# EAGLE board WMHS Team A Mission Possible Electrical (EAGLE 8.5.2), part 1 of 2
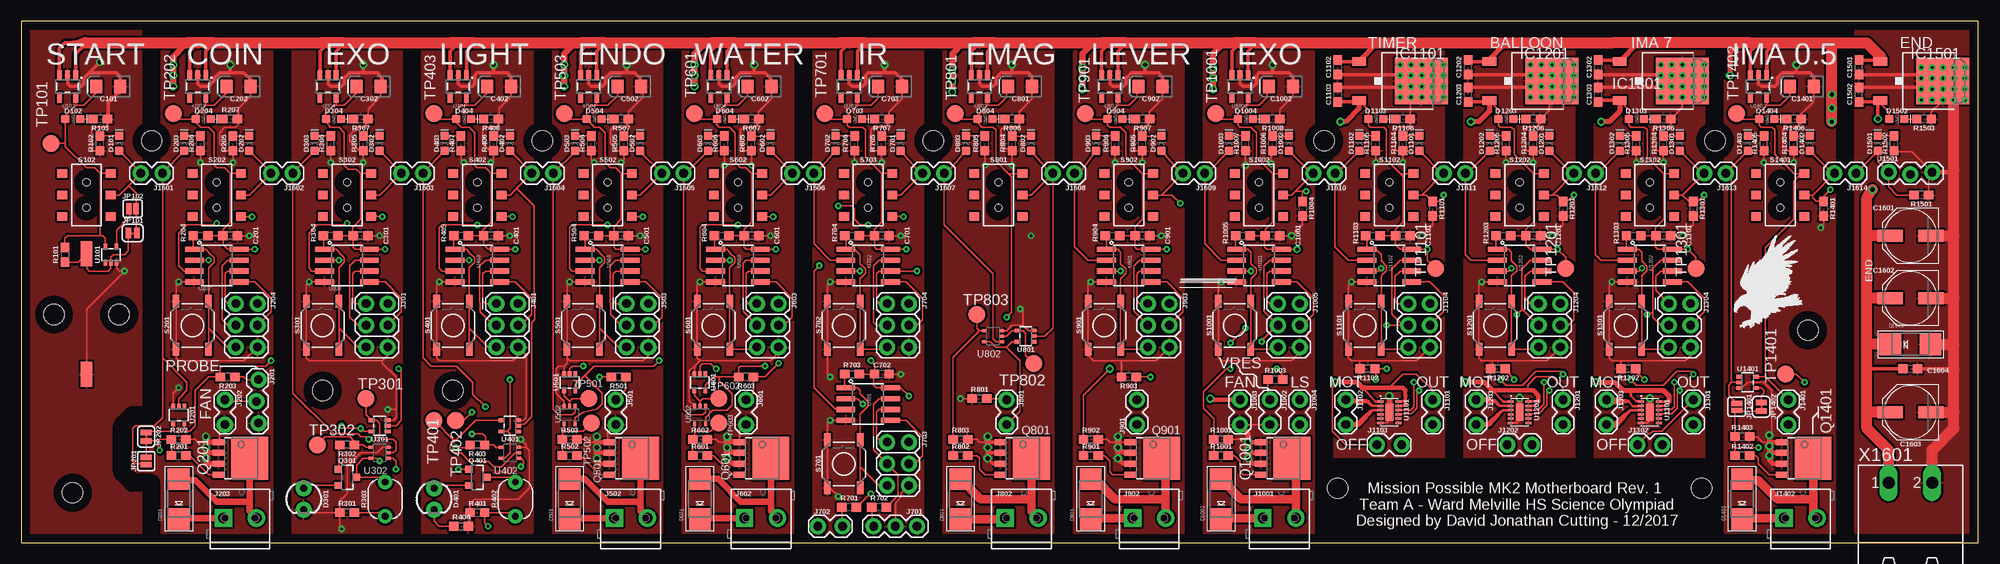
[diagram p16: board, top side]
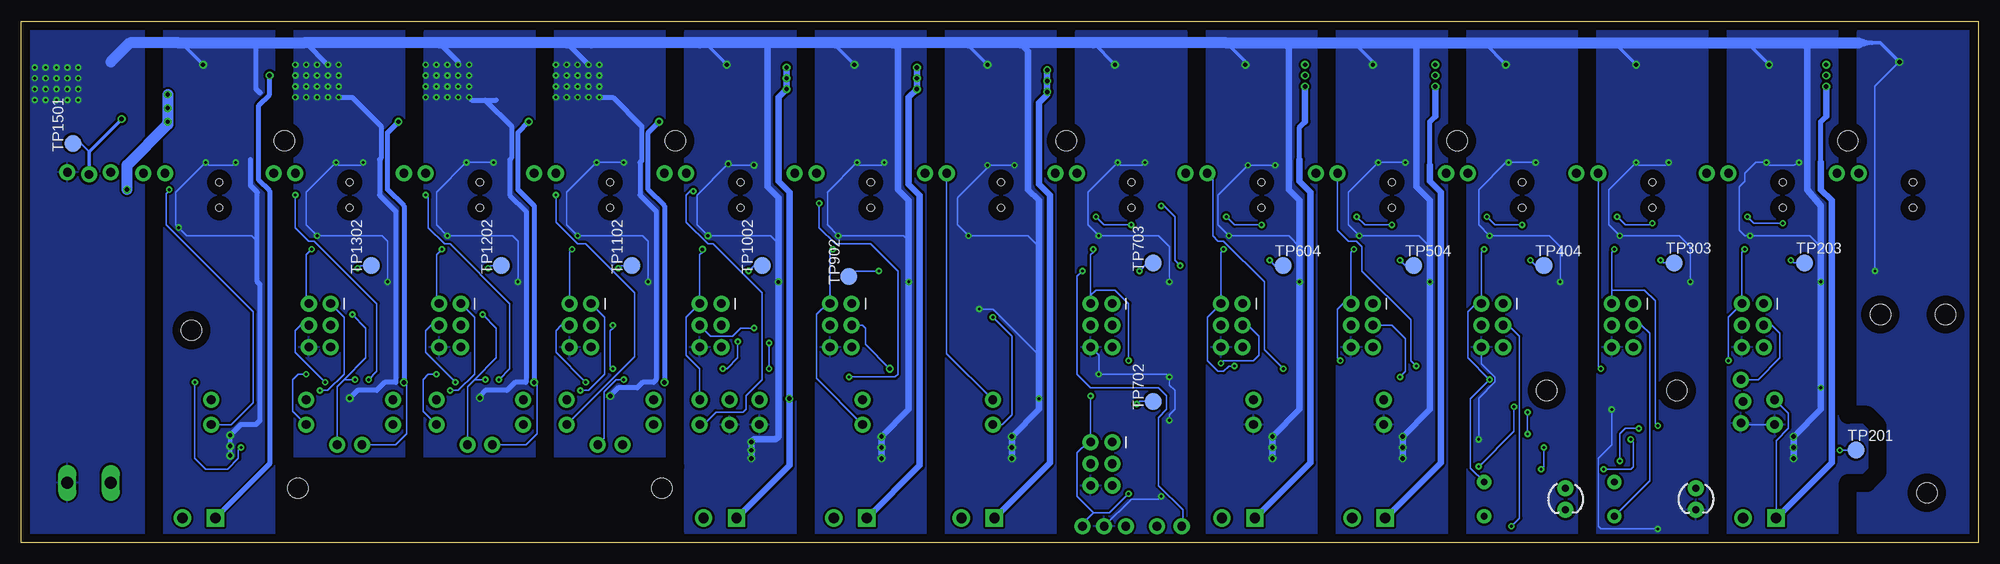
[diagram p17: board, bottom side, seen from below]

Size 228.9 x 60.95 mm. Coordinates in mm from the lower left corner, seen from the top.
Outline: 0,0 228.9,0 228.9,60.95 0,60.95 0,0
Copper layers (1*16): Top 0.035mm / dielectric 1.5mm / Bottom 0.035mm
Design rules "default *": minimum track width 6mil, minimum drill 13mil, track to track 6mil, track to pad 6mil, pad to pad 6mil, via to via 6mil, smd to smd 6mil, copper to edge 40mil, drill to drill 6mil, minimum pad ring 10mil, minimum via ring 8mil, stop-mask expansion 4mil, vias tented up to drill 25mil, thermal gap 10mil
Holes 2.4 mm at 11.43,26.67 3.81,26.67 35.24,17.78 50.48,17.78 209,24.82 6,5.82 15.24,46.99 60.96,46.99 106.68,46.99 152.4,46.99 198.12,46.99 153.99,6.35 196.53,6.35
tRestrict: 23 lines
bRestrict: 23 lines

## Footprints (pad centres in the part's own frame; a part is rotated, then mirrored left to right if it is on the bottom)
EIA3216 = smd 1.4 x 1.6: + 1.4,0; - -1.4,0
0603 = smd 1.1 x 1: 1 -0.85,0; 2 0.85,0
PANASONIC_D = smd 3 x 1.4: + 2.4,0; - -2.4,0
LED-0603 = smd 1 x 1: A -0.877,0; C 0.877,0
SMADIODE = smd 2.54 x 2.54: A 2.349,0; C -2.349,0
LED_3MM = drill 0.813 pad 1.88: A -1.27,0; K 1.27,0
TO252 = smd 1 x 1.6: 1 -2.28,-4.8; 2 2.28,-4.8 | smd 5.4 x 6.2: 3 0,2.5
1X03_LOCK = drill 1.016 pad 1.88: 1 0,0.127; 2 2.54,-0.127; 3 5.08,0.127
1X02_LOCK = drill 1.016 pad 1.88: 1 -0.178,0; 2 2.718,0
SCREWTERMINAL-3.5MM-2_LOCK = drill 1.2 pad 2.032 square: 1 -0.178,0 | drill 1.2 pad 2.032: 2 3.678,0
2X3 = drill 1.016 pad 1.88: 1 0,0; 2 0,2.54; 3 2.54,0; 4 2.54,2.54; 5 5.08,0; 6 5.08,2.54
1X03 = drill 1.016 pad 1.88: 1 0,0; 2 2.54,0; 3 5.08,0
1X02 = drill 1.016 pad 1.88: 1 0,0; 2 2.54,0
SMT-JUMPER_2_NC_TRACE_SILK = smd 0.635 x 1.27: 1 -0.508,0; 2 0.508,0
SMT-JUMPER_2_NO_SILK = smd 0.635 x 1.27: 1 -0.406,0; 2 0.406,0
SOT669 = smd 0.7 x 1.4: 1 -1.905,-2.65; 2 -0.635,-2.65; 3 0.635,-2.65; 4 1.905,-2.65 | smd 5 x 4.3: MB 0,1
SOT23-3 = smd 0.8 x 0.9: 1 -0.95,-1; 2 0.95,-1; 3 0,1.1
PHOTOCELL = drill 0.8 pad 1.676: 1 -2,0; 2 2,0
AXIAL_GULLWING_REED = smd 2.9 x 1.3: P$1 0,0; P$2 14.1,0
SWITCH_DPDT_SMD_AYZ0202 = smd 1 x 1.15: 1 -2.5,2.825; 2 0,2.825; 3 2.5,2.825; 4 -2.5,-2.825; 5 0,-2.825; 6 2.5,-2.825 | hole 0.85: 1.5,0; -1.5,0
TACTILE_SWITCH_SMD_5.2MM = smd 1.524 x 0.762: 1 -2.794,1.905; 2 2.794,1.905; 3 -2.794,-1.905; 4 2.794,-1.905
TP20R = smd 2 x 2: TP 0,0
SOT353 = smd 0.42 x 0.7: 1 -0.65,-0.95; 2 0,-0.95; 3 0.65,-0.95; 4 0.65,0.95; 5 -0.65,0.95
SOT23-5 = smd 0.55 x 1.2: 1 -0.95,-1.3; 2 0,-1.3; 3 0.95,-1.3; 4 0.95,1.3; 5 -0.95,1.3
SOIC8 = smd 0.61 x 2.21: 1 -1.905,-2.616; 2 -0.635,-2.616; 3 0.635,-2.616; 4 1.905,-2.616; 5 1.905,2.616; 6 0.635,2.616; 7 -0.635,2.616; 8 -1.905,2.616
SC-70-5 = smd 0.35 x 0.5: 1 -0.65,-1.05; 2 0,-1.05; 3 0.65,-1.05; 4 0.65,1.05; 5 -0.65,1.05
WSON-12 = smd 0.3 x 0.7: 1 -1.25,-1.05; 2 -0.75,-1.05; 3 -0.25,-1.05; 4 0.25,-1.05; 5 0.75,-1.05; 6 1.25,-1.05; 7 1.25,1.05; 8 0.75,1.05; 9 0.25,1.05; 10 -0.25,1.05; 11 -0.75,1.05; 12 -1.25,1.05 | smd 2 x 0.9: PAD 0,0
MSTBA2 = drill 1.397 long: 1 -2.54,5.08; 2 2.54,5.08

## Placement (x,y rotation side)
C101  2.2uF  [EIA3216]  10.16,53.34 180 top
C201  0.1uF  [0603]  24.45,35.88 180 top
C202  2.2uF  [EIA3216]  25.4,53.34 180 top
C301  0.1uF  [0603]  39.69,35.88 180 top
C302  2.2uF  [EIA3216]  40.64,53.34 180 top
C401  0.1uF  [0603]  54.93,35.88 180 top
C402  2.2uF  [EIA3216]  55.88,53.34 180 top
C501  0.1uF  [0603]  70.17,35.88 180 top
C502  2.2uF  [EIA3216]  71.12,53.34 180 top
C601  0.1uF  [0603]  85.41,35.88 180 top
C602  2.2uF  [EIA3216]  86.36,53.34 180 top
C701  0.1uF  [0603]  100.65,35.88 180 top
C702  0.1uF  [0603]  100.65,19.68 180 top
C703  2.2uF  [EIA3216]  101.6,53.34 180 top
C801  2.2uF  [EIA3216]  116.84,53.34 180 top
C901  0.1uF  [0603]  131.13,35.88 180 top
C902  2.2uF  [EIA3216]  132.08,53.34 180 top
C1001  0.1uF  [0603]  146.37,35.88 180 top
C1002  2.2uF  [EIA3216]  147.32,53.34 180 top
C1101  0.1uF  [0603]  161.61,35.88 180 top
C1102  0.33uF  [0603]  153.99,55.56 90 top
C1103  0.1uF  [0603]  153.99,52.39 90 top
C1201  0.1uF  [0603]  176.85,35.88 180 top
C1202  0.33uF  [0603]  169.23,55.56 90 top
C1203  0.1uF  [0603]  169.23,52.39 90 top
C1301  0.1uF  [0603]  192.09,35.88 180 top
C1302  0.33uF  [0603]  184.47,55.56 90 top
C1303  0.1uF  [0603]  184.47,52.39 90 top
C1401  2.2uF  [EIA3216]  208.28,53.34 180 top
C1501  0.33uF  [0603]  214.95,55.56 90 top
C1502  0.1uF  [0603]  214.95,52.39 90 top
C1601  100uF  [PANASONIC_D]  220.98,35.88 180 top
C1602  100uF  [PANASONIC_D]  220.98,28.57 180 top
C1603  100uF  [PANASONIC_D]  220.98,15.24 180 top
C1604  0.1uF  [0603]  220.98,20.32 0 top
D101  GREEN  [LED-0603]  11.43,46.67 90 top
D102  RED  [LED-0603]  6.03,49.53 0 top
D201  SK310A-TP  [SMADIODE]  18.41,5.08 90 top
D202  GREEN  [LED-0603]  26.67,46.67 90 top
D203  YELLOW  [LED-0603]  19.05,46.67 90 top
D204  RED  [LED-0603]  21.27,49.53 0 top
D301  INCANDESCENT  [LED_3MM]  33.02,5.08 270 top
D302  GREEN  [LED-0603]  41.91,46.67 90 top
D303  YELLOW  [LED-0603]  34.29,46.67 90 top
D304  RED  [LED-0603]  36.51,49.53 0 top
D401  WHITE  [LED_3MM]  48.26,5.08 270 top
D402  GREEN  [LED-0603]  57.15,46.67 90 top
D403  YELLOW  [LED-0603]  49.53,46.67 90 top
D404  RED  [LED-0603]  51.75,49.53 0 top
D501  SK310A-TP  [SMADIODE]  64.14,5.08 90 top
D502  GREEN  [LED-0603]  72.39,46.67 90 top
D503  YELLOW  [LED-0603]  64.77,46.67 90 top
D504  RED  [LED-0603]  66.99,49.53 0 top
D601  SK310A-TP  [SMADIODE]  79.38,5.08 90 top
D602  GREEN  [LED-0603]  87.63,46.67 90 top
D603  YELLOW  [LED-0603]  80.33,46.67 90 top
D604  RED  [LED-0603]  82.23,49.53 0 top
D701  GREEN  [LED-0603]  102.87,46.67 90 top
D702  YELLOW  [LED-0603]  95.25,46.67 90 top
D703  RED  [LED-0603]  97.47,49.53 0 top
D801  SK310A-TP  [SMADIODE]  109.86,5.08 90 top
D802  GREEN  [LED-0603]  118.11,46.67 90 top
D803  YELLOW  [LED-0603]  110.49,46.67 90 top
D804  RED  [LED-0603]  112.71,49.53 0 top
D901  SK310A-TP  [SMADIODE]  125.09,5.08 90 top
D902  GREEN  [LED-0603]  133.35,46.67 90 top
D903  YELLOW  [LED-0603]  125.73,46.67 90 top
D904  RED  [LED-0603]  127.95,49.53 0 top
D1001  SK310A-TP  [SMADIODE]  140.34,5.08 90 top
D1002  GREEN  [LED-0603]  148.27,46.67 90 top
D1003  YELLOW  [LED-0603]  141.29,46.67 90 top
D1004  RED  [LED-0603]  143.19,49.53 0 top
D1101  GREEN  [LED-0603]  163.51,46.67 90 top
D1102  YELLOW  [LED-0603]  156.53,46.67 90 top
D1103  RED  [LED-0603]  158.43,49.53 0 top
D1201  GREEN  [LED-0603]  178.75,46.67 90 top
D1202  YELLOW  [LED-0603]  171.77,46.67 90 top
D1203  RED  [LED-0603]  173.67,49.53 0 top
D1301  GREEN  [LED-0603]  193.99,46.67 90 top
D1302  YELLOW  [LED-0603]  187.01,46.67 90 top
D1303  RED  [LED-0603]  188.91,49.53 0 top
D1401  SK310A-TP  [SMADIODE]  201.29,5.08 90 top
D1402  GREEN  [LED-0603]  209.23,46.67 90 top
D1403  YELLOW  [LED-0603]  201.93,46.67 90 top
D1404  RED  [LED-0603]  204.15,49.53 0 top
D1501  YELLOW  [LED-0603]  217.17,46.67 90 top
D1502  RED  [LED-0603]  219.39,49.53 0 top
D1601  SMAJ30A  [SMADIODE]  220.98,23.18 0 top
IC1101  7805DT  [TO252]  161.29,53.98 270 top
IC1201  7805DT  [TO252]  176.53,53.98 270 top
IC1301  7805DT  [TO252]  191.77,53.98 270 top
IC1501  7805DT  [TO252]  222.25,53.98 270 top
J201  [1X03_LOCK]  27.62,19.05 270 top
J202  [1X02_LOCK]  23.81,16.51 270 top
J203  [SCREWTERMINAL-3.5MM-2_LOCK]  23.81,2.86 0 top
J204  ICSP_HEADER  [2X3]  25.08,27.94 270 top
J301  ICSP_HEADER  [2X3]  40.32,27.94 270 top
J401  ICSP_HEADER  [2X3]  55.56,27.94 270 top
J501  [1X02_LOCK]  69.53,16.51 270 top
J502  [SCREWTERMINAL-3.5MM-2_LOCK]  69.53,2.86 0 top
J503  ICSP_HEADER  [2X3]  70.8,27.94 270 top
J601  [1X02_LOCK]  84.77,16.51 270 top
J602  [SCREWTERMINAL-3.5MM-2_LOCK]  84.77,2.86 0 top
J603  ICSP_HEADER  [2X3]  86.04,27.94 270 top
J701  [1X03]  99.69,1.91 0 top
J702  [1X02_LOCK]  93.34,1.91 0 top
J703  ICSP_HEADER  [2X3]  101.28,11.75 270 top
J704  ICSP_HEADER  [2X3]  101.28,27.94 270 top
J801  [1X02_LOCK]  115.25,16.51 270 top
J802  [SCREWTERMINAL-3.5MM-2_LOCK]  115.25,2.86 0 top
J901  [1X02_LOCK]  130.49,13.97 90 top
J902  [SCREWTERMINAL-3.5MM-2_LOCK]  130.18,2.86 0 top
J903  ICSP_HEADER  [2X3]  131.76,27.94 270 top
J1001  [SCREWTERMINAL-3.5MM-2_LOCK]  145.41,2.86 0 top
J1002  [1X02_LOCK]  146.05,16.51 270 top
J1003  [1X02_LOCK]  142.56,16.51 270 top
J1004  [1X02_LOCK]  149.54,16.51 270 top
J1005  ICSP_HEADER  [2X3]  147,27.94 270 top
J1101  [1X02_LOCK]  165.1,16.51 270 top
J1102  [1X02_LOCK]  154.94,16.51 270 top
J1103  [1X02_LOCK]  158.75,11.43 0 top
J1104  ICSP_HEADER  [2X3]  162.24,27.94 270 top
J1201  [1X02_LOCK]  180.34,16.51 270 top
J1202  [1X02_LOCK]  173.99,11.43 0 top
J1203  [1X02_LOCK]  170.18,16.51 270 top
J1204  ICSP_HEADER  [2X3]  177.48,27.94 270 top
J1301  [1X02_LOCK]  195.58,16.51 270 top
J1302  [1X02_LOCK]  189.23,11.43 0 top
J1303  [1X02_LOCK]  185.42,16.51 270 top
J1304  ICSP_HEADER  [2X3]  192.72,27.94 270 top
J1401  [1X02_LOCK]  206.69,16.51 270 top
J1402  [SCREWTERMINAL-3.5MM-2_LOCK]  206.38,2.86 0 top
J1501  [1X03_LOCK]  218.44,43.18 0 top
J1601  [1X02]  16.51,43.18 180 top
J1602  [1X02]  31.75,43.18 180 top
J1603  [1X02]  46.99,43.18 180 top
J1604  [1X02]  62.23,43.18 180 top
J1605  [1X02]  77.47,43.18 180 top
J1606  [1X02]  92.71,43.18 180 top
J1607  [1X02]  107.95,43.18 180 top
J1608  [1X02]  123.19,43.18 180 top
J1609  [1X02]  138.43,43.18 180 top
J1610  [1X02]  153.67,43.18 180 top
J1611  [1X02]  168.91,43.18 180 top
J1612  [1X02]  184.15,43.18 180 top
J1613  [1X02]  199.39,43.18 180 top
J1614  [1X02]  214.63,43.18 180 top
JP101  JUMPER_NC_TRACE  [SMT-JUMPER_2_NC_TRACE_SILK]  13.02,36.2 0 top
JP102  JUMPER-SMT_2_NO_SILK  [SMT-JUMPER_2_NO_SILK]  13.02,39.05 0 top
JP201  JUMPER-SMT_2_NO_SILK  [SMT-JUMPER_2_NO_SILK]  14.61,9.53 90 top
JP202  JUMPER-SMT_2_NC_TRACE_SILK  [SMT-JUMPER_2_NC_TRACE_SILK]  14.61,12.38 270 top
JP1401  JUMPER-SMT_2_NO_SILK  [SMT-JUMPER_2_NO_SILK]  200.66,15.88 270 top
JP1402  JUMPER-SMT_2_NC_TRACE_SILK  [SMT-JUMPER_2_NC_TRACE_SILK]  203.52,15.88 270 top
Q201  PSMN7R0-60YS  [SOT669]  25.72,9.84 270 top
Q301  500mA/300V  [SOT23-3]  38.1,7.62 270 top
Q401  500mA/300V  [SOT23-3]  53.34,7.62 270 top
Q501  PSMN7R0-60YS  [SOT669]  71.44,9.84 270 top
Q601  PSMN7R0-60YS  [SOT669]  86.68,9.84 270 top
Q801  PSMN7R0-60YS  [SOT669]  117.16,9.84 270 top
Q901  PSMN7R0-60YS  [SOT669]  132.4,9.84 270 top
Q1001  PSMN7R0-60YS  [SOT669]  147.64,9.84 270 top
Q1401  PSMN7R0-60YS  [SOT669]  208.6,9.84 270 top
R101  10K  [0603]  5.08,33.66 270 top
R102  560r  [0603]  9.21,46.67 90 top
R103  560r  [0603]  9.21,49.53 180 top
R201  10R  [0603]  18.41,10.16 0 top
R202  100K  [0603]  18.41,12.06 0 top
R203  10k  [0603]  24.13,19.37 180 top
R204  10K  [0603]  20.95,35.88 0 top
R205  560r  [0603]  24.77,46.67 90 top
R206  560r  [0603]  20.95,46.67 90 top
R207  560r  [0603]  24.45,49.53 180 top
R301  10K  [0603]  38.1,3.49 0 top
R302  1K  [0603]  38.1,11.43 180 top
R303  PHOTOCELLPTH  [PHOTOCELL]  42.55,5.08 90 top
R304  10K  [0603]  36.2,35.88 0 top
R305  560r  [0603]  40.01,46.67 90 top
R306  560r  [0603]  36.2,46.67 90 top
R307  560r  [0603]  39.69,49.53 180 top
R401  10K  [0603]  53.34,3.49 0 top
R402  PHOTOCELLPTH  [PHOTOCELL]  57.78,5.08 90 top
R403  1K  [0603]  53.34,11.43 180 top
R404  560  [0603]  51.44,1.91 0 top
R405  10K  [0603]  51.44,35.88 0 top
R406  560r  [0603]  55.24,46.67 90 top
R407  560r  [0603]  51.44,46.67 90 top
R408  560r  [0603]  54.93,49.53 180 top
R501  0R  [0603]  69.85,19.37 180 top
R502  10R  [0603]  64.14,10.16 0 top
R503  100K  [0603]  64.14,12.06 0 top
R504  10K  [0603]  66.67,35.88 0 top
R505  560r  [0603]  70.48,46.67 90 top
R506  560r  [0603]  66.67,46.67 90 top
R507  560r  [0603]  70.17,49.53 180 top
R601  10R  [0603]  79.38,10.16 0 top
R602  100K  [0603]  79.38,12.06 0 top
R603  1M  [0603]  84.77,19.37 180 top
R604  10K  [0603]  81.92,35.88 0 top
R605  560r  [0603]  85.41,46.67 90 top
R606  560r  [0603]  82.23,46.67 90 top
R607  560r  [0603]  85.41,49.53 180 top
R701  330r  [0603]  96.84,4.13 180 top
R702  33k  [0603]  100.33,4.13 180 top
R703  10K  [0603]  97.16,19.68 0 top
R704  10K  [0603]  97.16,35.88 0 top
R705  560r  [0603]  100.65,46.67 90 top
R706  560r  [0603]  97.47,46.67 90 top
R707  560r  [0603]  100.65,49.53 180 top
R801  10K  [0603]  112.08,16.83 0 top
R802  10R  [0603]  109.86,10.16 0 top
R803  100K  [0603]  109.86,12.06 0 top
R804  560r  [0603]  115.89,46.67 90 top
R805  560r  [0603]  112.71,46.67 90 top
R806  560r  [0603]  115.89,49.53 180 top
R901  10R  [0603]  125.09,10.16 0 top
R902  100K  [0603]  125.09,12.06 0 top
R903  10K  [0603]  129.54,19.37 180 top
R904  10K  [0603]  127.64,35.88 0 top
R905  560r  [0603]  131.13,46.67 90 top
R906  560r  [0603]  127.95,46.67 90 top
R907  560r  [0603]  131.13,49.53 180 top
R1001  10R  [0603]  140.34,10.16 0 top
R1002  100K  [0603]  140.34,12.06 0 top
R1003  100K  [0603]  146.69,19.05 0 top
R1004  1M  [0603]  149.86,39.05 270 top
R1005  10K  [0603]  142.88,35.88 0 top
R1006  560r  [0603]  146.37,46.67 90 top
R1007  560r  [0603]  143.19,46.67 90 top
R1008  560r  [0603]  146.37,49.53 180 top
R1101  10K  [0603]  165.1,39.05 270 top
R1102  10K  [0603]  157.48,20.32 180 top
R1103  10K  [0603]  158.12,35.88 0 top
R1104  560r  [0603]  161.61,46.67 90 top
R1105  560r  [0603]  158.43,46.67 90 top
R1106  560r  [0603]  161.61,49.53 180 top
R1201  10K  [0603]  180.34,39.05 270 top
R1202  10K  [0603]  172.72,20.32 180 top
R1203  10K  [0603]  173.35,35.88 0 top
R1204  560r  [0603]  176.85,46.67 90 top
R1205  560r  [0603]  173.67,46.67 90 top
R1206  560r  [0603]  176.85,49.53 180 top
R1301  10K  [0603]  195.58,39.05 270 top
R1302  10K  [0603]  187.96,20.32 180 top
R1303  10K  [0603]  188.59,35.88 0 top
R1304  560r  [0603]  192.09,46.67 90 top
R1305  560r  [0603]  188.91,46.67 90 top
R1306  560r  [0603]  192.09,49.53 180 top
R1401  10K  [0603]  210.82,39.05 270 top
R1402  10R  [0603]  201.29,10.16 0 top
R1403  100K  [0603]  201.29,12.38 0 top
R1404  560r  [0603]  207.33,46.67 90 top
R1405  560r  [0603]  203.84,46.67 90 top
R1406  560r  [0603]  207.33,49.53 180 top
R1501  10K  [0603]  222.25,40.64 180 top
R1502  560r  [0603]  219.07,46.67 90 top
R1503  560r  [0603]  222.57,49.53 180 top
S101  REED_SWITCH  [AXIAL_GULLWING_REED]  7.62,19.68 90 top
S102  [SWITCH_DPDT_SMD_AYZ0202]  7.62,40.64 270 top
S201  RST  [TACTILE_SWITCH_SMD_5.2MM]  20,25.4 90 top
S202  [SWITCH_DPDT_SMD_AYZ0202]  22.86,40.64 270 top
S301  RST  [TACTILE_SWITCH_SMD_5.2MM]  35.24,25.4 90 top
S302  [SWITCH_DPDT_SMD_AYZ0202]  38.1,40.64 270 top
S401  RST  [TACTILE_SWITCH_SMD_5.2MM]  50.48,25.4 90 top
S402  [SWITCH_DPDT_SMD_AYZ0202]  53.34,40.64 270 top
S501  RST  [TACTILE_SWITCH_SMD_5.2MM]  65.72,25.4 90 top
S502  [SWITCH_DPDT_SMD_AYZ0202]  68.58,40.64 270 top
S601  RST  [TACTILE_SWITCH_SMD_5.2MM]  80.96,25.4 90 top
S602  [SWITCH_DPDT_SMD_AYZ0202]  83.82,40.64 270 top
S701  RST  [TACTILE_SWITCH_SMD_5.2MM]  96.2,9.21 90 top
S702  RST  [TACTILE_SWITCH_SMD_5.2MM]  96.2,25.4 90 top
S703  [SWITCH_DPDT_SMD_AYZ0202]  99.06,40.64 270 top
S801  [SWITCH_DPDT_SMD_AYZ0202]  114.3,40.64 270 top
S901  RST  [TACTILE_SWITCH_SMD_5.2MM]  126.68,25.4 90 top
S902  [SWITCH_DPDT_SMD_AYZ0202]  129.54,40.64 270 top
S1001  RST  [TACTILE_SWITCH_SMD_5.2MM]  141.92,25.4 90 top
S1002  [SWITCH_DPDT_SMD_AYZ0202]  144.78,40.64 270 top
S1101  RST  [TACTILE_SWITCH_SMD_5.2MM]  157.16,25.4 90 top
S1102  [SWITCH_DPDT_SMD_AYZ0202]  160.02,40.64 270 top
S1201  RST  [TACTILE_SWITCH_SMD_5.2MM]  172.4,25.4 90 top
S1202  [SWITCH_DPDT_SMD_AYZ0202]  175.26,40.64 270 top
S1301  RST  [TACTILE_SWITCH_SMD_5.2MM]  187.64,25.4 90 top
S1302  [SWITCH_DPDT_SMD_AYZ0202]  190.5,40.64 270 top
S1401  [SWITCH_DPDT_SMD_AYZ0202]  205.74,40.64 270 top
TP101  PTR1TP20R  [TP20R]  3.49,46.67 0 top
TP201  PTR1TP20R  [TP20R]  14.29,10.79 0 bottom
TP202  PTR1TP20R  [TP20R]  17.78,50.16 0 top
TP203  PTR1TP20R  [TP20R]  20.32,32.7 0 bottom
TP301  PTR1TP20R  [TP20R]  40.32,16.83 0 top
TP302  PTR1TP20R  [TP20R]  34.61,11.43 0 top
TP303  PTR1TP20R  [TP20R]  35.56,32.7 0 bottom
TP401  PTR1TP20R  [TP20R]  48.26,14.29 0 top
TP402  PTR1TP20R  [TP20R]  50.8,14.29 0 top
TP403  PTR1TP20R  [TP20R]  48.26,50.16 0 top
TP404  PTR1TP20R  [TP20R]  50.8,32.38 0 bottom
TP501  PTR1TP20R  [TP20R]  66.36,16.83 0 top
TP502  PTR1TP20R  [TP20R]  66.67,13.97 0 top
TP503  PTR1TP20R  [TP20R]  63.5,50.16 0 top
TP504  PTR1TP20R  [TP20R]  66.04,32.38 0 bottom
TP601  PTR1TP20R  [TP20R]  78.74,50.16 0 top
TP602  PTR1TP20R  [TP20R]  81.6,16.83 90 top
TP603  PTR1TP20R  [TP20R]  81.6,13.97 90 top
TP604  PTR1TP20R  [TP20R]  81.28,32.38 0 bottom
TP701  PTR1TP20R  [TP20R]  93.98,50.16 90 top
TP702  PTR1TP20R  [TP20R]  96.52,16.51 90 bottom
TP703  PTR1TP20R  [TP20R]  96.52,32.7 90 bottom
TP801  PTR1TP20R  [TP20R]  109.22,50.16 90 top
TP802  PTR1TP20R  [TP20R]  118.43,20.95 90 top
TP803  PTR1TP20R  [TP20R]  111.76,26.67 90 top
TP901  PTR1TP20R  [TP20R]  124.46,50.16 90 top
TP902  PTR1TP20R  [TP20R]  132.08,31.11 90 bottom
TP1001  PTR1TP20R  [TP20R]  139.7,50.16 90 top
TP1002  PTR1TP20R  [TP20R]  142.24,32.38 90 bottom
TP1101  PTR1TP20R  [TP20R]  165.42,32.07 90 top
TP1102  PTR1TP20R  [TP20R]  157.48,32.38 90 bottom
TP1201  PTR1TP20R  [TP20R]  180.66,32.07 90 top
TP1202  PTR1TP20R  [TP20R]  172.72,32.38 90 bottom
TP1301  PTR1TP20R  [TP20R]  195.9,32.07 90 top
TP1302  PTR1TP20R  [TP20R]  187.96,32.38 90 bottom
TP1401  PTR1TP20R  [TP20R]  206.38,19.68 90 top
TP1402  PTR1TP20R  [TP20R]  200.66,50.16 90 top
TP1501  PTR1TP20R  [TP20R]  222.88,46.67 90 bottom
U101  74HC1G04  [SOT353]  10.48,33.66 0 top
U102  MIC5205  [SOT23-5]  5.4,53.34 180 top
U201  74HC1G04  [SOT353]  18.41,14.92 180 top
U202  ATTINY25-20SSUR  [SOIC8]  22.86,32.38 270 top
U203  MIC5205  [SOT23-5]  20.64,53.34 180 top
U301  74HC1G04  [SOT353]  41.91,13.65 90 top
U302  SN74*C1G08-DCK  [SC-70-5]  41.91,10.48 90 top
U303  ATTINY25-20SSUR  [SOIC8]  38.1,32.38 270 top
U304  MIC5205  [SOT23-5]  35.88,53.34 180 top
U401  74HC1G04  [SOT353]  57.15,13.65 90 top
U402  SN74*C1G08-DCK  [SC-70-5]  57.15,10.48 90 top
U403  ATTINY25-20SSUR  [SOIC8]  53.34,32.38 270 top
U404  MIC5205  [SOT23-5]  51.12,53.34 180 top
U501  74HC1G04  [SOT353]  64.14,18.73 180 top
U502  SN74*C1G08-DCK  [SC-70-5]  64.14,14.92 180 top
U503  ATTINY25-20SSUR  [SOIC8]  68.58,32.38 270 top
U504  MIC5205  [SOT23-5]  66.36,53.34 180 top
U601  74HC1G04  [SOT353]  79.38,18.73 180 top
U602  SN74*C1G08-DCK  [SC-70-5]  79.38,14.92 180 top
U603  ATTINY25-20SSUR  [SOIC8]  83.82,32.38 270 top
U604  MIC5205  [SOT23-5]  81.6,53.34 180 top
U701  ATTINY25-20SSUR  [SOIC8]  99.06,16.19 270 top
U702  ATTINY25-20SSUR  [SOIC8]  99.06,32.38 270 top
U703  MIC5205  [SOT23-5]  96.84,53.34 180 top
U801  74HC1G04  [SOT353]  117.47,24.13 90 top
U802  SN74*C1G08-DCK  [SC-70-5]  113.67,24.13 90 top
U803  MIC5205  [SOT23-5]  112.08,53.34 180 top
U901  ATTINY25-20SSUR  [SOIC8]  129.54,32.38 270 top
U902  MIC5205  [SOT23-5]  127.32,53.34 180 top
U1001  ATTINY25-20SSUR  [SOIC8]  144.78,32.38 270 top
U1002  MIC5205  [SOT23-5]  142.56,53.34 180 top
U1101  DRV8835  [WSON-12]  160.02,15.24 270 top
U1102  ATTINY25-20SSUR  [SOIC8]  160.02,32.38 270 top
U1201  DRV8835  [WSON-12]  175.26,15.24 270 top
U1202  ATTINY25-20SSUR  [SOIC8]  175.26,32.38 270 top
U1301  DRV8835  [WSON-12]  190.5,15.24 270 top
U1302  ATTINY25-20SSUR  [SOIC8]  190.5,32.38 270 top
U1401  74HC1G04  [SOT353]  201.93,18.73 270 top
U1402  MIC5205  [SOT23-5]  203.2,53.34 180 top
U$2  [EAGLE-PLC-8MM]  200.34,25.08 0 top
X1601  MSTBA2  [MSTBA2]  220.98,1.91 0 top

## Tracks (layer width: path | path; a pad name or v marks a point on that pad's centre or on a via)
BALLOON_IN
  Top 0.203: D1202.A 169.15,43.18 J1611.1 168.91,33.66 169.54,33.02 U1202.2
BALLOON_MISO  (via drill 0.33)
  Top 0.203: U1202.6 176.53,31.75 175.9,31.11 175.9,28.57 176.53,27.94 J1204.1 | U1201.9 176.41,15.09 177.51,15.09 178.47,16.05 178.47,17.51 v178.74,17.78
  Bottom 0.203: v178.74,17.78 177.8,17.78 175.9,19.68 175.9,26.35 J1204.1
BALLOON_MOSI  (via drill 0.33)
  Top 0.203: J1204.4 180.97,25.4 181.61,26.04 181.61,29.21 180.34,30.48 U1202.5 | U1201.10 177.41,15.49 178.12,16.19 v178.12,18.73
  Bottom 0.203: v178.12,18.73 181.61,22.23 181.61,24.77 180.97,25.4 J1204.4
BALLOON_OUT  (via drill 0.33)
  Top 0.203: S1202.2 179.07,40.64 | 179.07,40.64 J1612.2 181.37,43.18 D1201.A | R1201.1 180.29,39.95 | 180.29,39.95 179.6,40.64 179.07,40.64 | v180.34,19.68 180.02,20 177.16,20 175.58,18.41 173.67,18.41 v173.04,19.05 | v181.61,40.64 180.92,39.95 180.29,39.95
  Bottom 0.203: J1201.2 181.93,15.38 181.93,19.05 181.29,19.68 v180.34,19.68 | v173.04,19.05 171.77,20.32 171.77,27.94 178.75,34.92 179.39,34.92 181.29,36.83 181.29,40.32 v181.61,40.64
BALLOON_RST
  Top 0.203: R1203.1 172.5,34.43 U1202.1 173.99,34.29 174.31,33.97 174.31,32.95 174.93,32.33 174.93,31.81 174.31,31.19 S1201.4 S1201.3 177.23,22.61 J1204.5
BALLOON_SCK  (via drill 0.33)
  Top 0.203: U1202.7 176.53,33.02 175.54,32.03 175.54,27.34 175.58,27.3 | 175.58,27.3 J1204.3 | v174.94,26.67 175.58,27.3 | v174.62,19.05 174.52,19.15 R1202.1
  Bottom 0.203: J1202.2 176.71,18.24 175.9,19.05 | v174.94,26.67 173.35,25.08 173.35,21.59 175.9,19.05 | 175.9,19.05 v174.62,19.05
BALLOON_VCC  (via drill 0.33, 0.51)
  Top 0.203: C1201.2 176,34.82 176.53,34.29 U1202.8 v179.71,34.29 180.66,33.34 TP1201.TP | S1202.1 176.89,43.14 176.85,43.18 | C1201.2 176,36.62 176.85,37.47 176.85,43.18 | 176.85,43.18 174.62,45.4 174.62,48.26 174.31,48.58 173.04,48.58 172.8,48.82 D1203.A 172.8,50.63 IC1201.2 | J1201.1 180.34,18.1 179.07,19.37 177.16,19.37 176.21,18.41 176.21,17.78 | R1203.2 C1201.2
  Top 0.305: U1201.1 173.38,16.49 172.09,17.78 | U1201.12 176.33,16.51 177.48,16.51 176.96,15.99 U1201.11 176.65,15.99
  Top 0.406: C1203.1 171.57,51.54 IC1201.2
  Top 0.508: 177.48,16.51 177.48,17.14 176.85,17.78 176.21,17.78 172.09,17.78
  Top 0.61: IC1201.2 171.73,50.45 170.5,49.21 v169.54,49.21 | 172.09,17.78 171.13,18.73 v168.91,18.73
  Bottom 0.203: J1204.2 180.34,28.26 180.34,33.66 v179.71,34.29 | J1202.1 169.86,11.43 168.59,12.7 168.59,18.41 v168.91,18.73
  Bottom 0.61: v168.91,18.73 168.91,39.37 170.81,41.27 170.81,47.94 v169.54,49.21
COIN_IN
  Top 0.203: D203.A 16.51,43.26 J1601.1 16.51,21.59 | 16.51,21.59 19.37,18.73 19.37,17.78 18.41,16.83 U201.2 | JP201.1 14.52,9.21 13.34,9.21 13.02,9.53 13.02,13.34 13.34,13.65 15.56,13.65 16.51,14.61 16.51,21.59
COIN_MISO
  Top 0.203: U202.6 24.13,31.75 23.85,31.47 23.85,28.26 24.17,27.94 J204.1
COIN_MOSI
  Top 0.203: U202.5 27.3,30.48 29.21,28.57 29.21,26.99 J204.4
COIN_OUT
  Top 0.203: S202.2 26.67,40.64 J1602.2 29.21,43.26 D202.A
COIN_OUT_SWITCH  (via drill 0.33)
  Top 0.203: U202.3 19.05,31.75 18.41,32.38 18.41,36.2 19.37,37.15 22.68,37.15 v22.86,37.33 | v26.99,38.1 25.73,38.1 S202.3
  Bottom 0.203: v22.86,37.33 26.22,37.33 v26.99,38.1
COIN_RST
  Top 0.203: R204.1 20.11,34.43 U202.1 21.59,34.29 21.91,33.97 21.91,33.9 22.53,33.28 22.53,32.76 21.91,32.14 S201.4 21.91,25.08 | 21.91,25.08 S201.3 | J204.5 24.13,22.86 21.91,25.08
COIN_SCK
  Top 0.203: U202.7 24.13,33.02 23.5,32.38 23.5,26.04 24.13,25.4 J204.3 | J201.1 26.35,19.05 26.04,19.37 R203.1
  Bottom 0.203: J201.1 25.72,19.05 23.18,21.59 23.18,24.45 24.13,25.4 J204.3
COIN_VCC  (via drill 0.33)
  Top 0.203: C201.2 R204.2 | C202.+ 24,52.58 22.54,51.12 21.59,51.12 | 21.59,51.12 U203.5 | D204.A 20.39,49.92 21.59,51.12 | S202.1 25.64,43.18 24.45,43.18 | 24.45,43.18 23.81,43.81 22.86,43.81 22.54,44.13 22.54,47.94 21.91,48.58 20.95,48.58 20.39,49.14 D204.A | 24.45,43.18 24.45,37.47 23.6,36.62 C201.2 | v27.3,34.29 U202.8 24.13,34.29 23.6,34.82 C201.2 | U201.5 19.07,13.35 19.05,13.34 19.37,13.02 19.68,13.02 20.32,13.65 20.32,17.78 21.91,19.37 R203.2 23.28,20.42 23.5,20.64 28.57,20.64 v29.21,21.27 | TP202.TP 18.41,49.53 D204.A
  Bottom 0.203: v27.3,34.29 27.62,33.97 J204.2 29.21,26.35 v29.21,21.27
EMAG_IN
  Top 0.203: D803.A 108.19,43.18 J1607.1 107.95,37.15 113.67,31.43 113.67,23.81 114,23.48 U802.1
EMAG_OUT
  Top 0.203: 120.41,43.18 J1608.2 118.11,40.64 S801.2 | 120.41,43.18 D802.A | J801.1 115.11,16.83 R801.2 | U801.2 119.7,24.13 120.65,25.08 120.65,42.94 120.41,43.18
  Bottom 0.203: J801.1 120.65,22.09 J1608.2
EMAG_VCC  (via drill 0.33)
  Top 0.203: C801.+ 115.25,53.15 115.25,52.07 114.3,51.12 113.03,51.12 | 113.03,51.12 U803.5 | 113.03,51.12 111.83,49.92 D804.A | U801.5 115.87,23.48 115.25,22.86 | 115.25,22.86 113.98,22.86 113.36,23.48 U802.5 | J801.2 116.84,15.38 116.84,21.27 115.25,22.86 | D804.A 111.83,49.14 112.39,48.58 113.67,48.58 113.98,48.26 113.98,44.64 115.48,43.14 | 115.48,43.14 S801.1 | 115.48,43.14 115.84,42.78 115.84,26.94 v115.25,26.35 | TP801.TP 109.86,49.53 D804.A
  Bottom 0.203: v115.25,26.35 113.03,24.13 113.03,14.92 114.16,13.79 J801.2
END_IN
  Top 0.203: J1614.1 214.63,43.26 217.13,45.76 | 217.13,45.76 D1501.A | 217.13,45.76 217.13,44.62 J1501.1 218.44,41.59 219.39,40.64 R1501.2
END_VCC  (via drill 0.51)
  Top 0.203: D1502.A 218.52,50.31 217.44,51.39 217.29,51.54
  Top 0.406: C1502.1 217.29,51.54 IC1501.2 | v217.17,49.53 217.17,51.12 217.44,51.39
  Bottom 0.203: TP1501.TP 221.93,46.67 220.98,45.72
  Bottom 0.406: J1501.2 220.98,45.72 v217.17,49.53
ENDO_IN
  Top 0.203: 62.47,43.18 J1604.1 | J1604.1 64.77,45.72 D503.A | U502.1 64.78,15.26 64.45,14.92 62.87,14.92 62.19,15.6 62.19,43.14 J1604.1
ENDO_MISO
  Top 0.203: J503.1 69.53,27.94 69.22,28.26 69.22,31.43 69.53,31.75 U503.6
ENDO_MOSI
  Top 0.203: U503.5 73.03,30.48 74.93,28.57 74.93,26.35 73.98,25.4 J503.4
ENDO_OUT  (via drill 0.33)
  Top 0.203: J1605.2 72.77,41.02 72.74,41.02 72.35,40.64 S502.2 | J1605.2 74.69,43.18 | J1605.2 72.39,45.72 D502.A | U501.2 64.14,20.32 64.45,20.64 v65.72,20.64
  Bottom 0.203: v65.72,20.64 66.36,21.27 66.36,26.04 72.07,31.75 72.07,34.61 72.71,35.24 73.66,35.24 74.93,36.51 J1605.2
ENDO_OUT_SWITCH  (via drill 0.33)
  Top 0.203: S502.3 71.44,38.1 v72.71,38.1 | v68.58,37.15 64.45,37.15 64.14,36.83 64.14,32.07 64.45,31.75 U503.3
  Bottom 0.203: v72.71,38.1 71.75,37.15 v68.58,37.15
ENDO_RST
  Top 0.203: S501.3 67.63,25.08 | 67.63,25.08 S501.4 67.63,32.14 68.25,32.76 68.25,33.28 67.63,33.9 67.63,33.97 67.31,34.29 U503.1 65.96,35.74 R504.1 | 67.63,25.08 69.85,22.86 J503.5
ENDO_SCK  (via drill 0.33)
  Top 0.203: J503.3 70.17,25.4 68.9,26.67 68.9,28.07 68.86,28.11 68.86,32.35 69.53,33.02 U503.7 | R501.2 v67.63,19.37
  Bottom 0.203: v67.63,19.37 66.99,20 66.99,23.81 68.58,25.4 J503.3
ENDO_VCC  (via drill 0.33)
  Top 0.203: U504.5 67.31,51.12 | 67.31,51.12 68.58,51.12 69.72,52.26 C502.+ | D504.A 67.07,48.58 67.63,48.58 68.26,47.94 68.26,44.45 68.9,43.81 69.53,43.81 70.17,43.18 | 70.17,43.18 70.21,43.14 S502.1 | C501.2 R504.2 | 70.17,43.18 70.17,37.78 69.32,36.93 C501.2 | v73.03,34.29 U503.8 69.53,34.29 69.32,34.51 C501.2 | U501.5 64.78,18.43 66.04,19.68 | v74.61,21.27 73.98,20.64 66.99,20.64 66.04,19.68 | D504.A 66.11,50.56 66.67,51.12 67.31,51.12 | U502.5 64.78,14.62 65.72,15.24 67.31,15.56 67.94,16.19 67.94,17.46 66.04,19.37 66.04,19.68 | TP503.TP 64.14,49.53 D504.A
  Bottom 0.203: v73.03,34.29 73.34,33.97 J503.2 74.3,27.94 74.93,27.3 74.93,21.59 v74.61,21.27
EXO_IN  (via drill 0.33)
  Top 0.203: D303.A 31.75,43.26 J1602.1 31.75,17.46 36.51,12.7 39.37,12.7 39.69,12.38 40.32,12.38 v40.64,12.06 | U302.1 42.98,9.84 43.5,9.84 43.81,9.53 v43.81,8.57
  Bottom 0.203: v43.81,8.57 40.64,8.57 40.32,8.89 40.32,11.75 v40.64,12.06
EXO_MISO
  Top 0.203: J301.1 39.05,27.94 38.73,28.26 38.73,31.43 39.05,31.75 U303.6
EXO_MOSI
  Top 0.203: J301.4 44.45,26.99 44.45,28.57 42.55,30.48 U303.5
EXO_OUT  (via drill 0.33)
  Top 0.203: S302.2 41.91,40.64 J1603.2 44.45,43.26 D302.A | U301.2 43.81,13.65 44.45,14.29 44.45,20 v44.13,20.32
  Bottom 0.203: v44.13,20.32 44.45,20.64 J1603.2
EXO_OUT_SWITCH  (via drill 0.33)
  Top 0.203: S302.3 42.19,38.14 v42.23,38.1 | v38.1,37.33 37.97,37.33 37.78,37.15 34.61,37.15 33.66,36.2 33.66,32.07 33.97,31.75 U303.3
  Bottom 0.203: v42.23,38.1 41.27,37.15 38.28,37.15 v38.1,37.33
EXO_RST
  Top 0.203: R304.1 35.34,34.43 U303.1 36.83,34.29 37.15,33.97 37.15,33.9 37.77,33.28 37.77,32.76 37.15,32.14 S301.4 37.15,25.08 | S301.3 37.15,25.08 | 37.15,25.08 39.37,22.86 J301.5
EXO_SCK
  Top 0.203: J301.3 39.37,25.4 38.42,26.35 38.42,28.07 38.38,28.11 38.38,32.35 39.05,33.02 U303.7 | R301.2 42.13,3.49 R303.1
  Bottom 0.203: R303.1 38.42,7.21 38.42,24.45 39.37,25.4 J301.3
EXO_VCC  (via drill 0.33)
  Top 0.203: C302.+ 39.24,52.58 37.78,51.12 36.83,51.12 | 36.83,51.12 U304.5 | 36.83,51.12 36.51,51.12 35.56,50.16 35.56,49.6 D304.A 35.64,49.14 36.2,48.58 37.15,48.58 37.78,47.94 37.78,44.13 38.23,43.68 39.19,43.68 39.69,43.18 | 39.69,43.18 40.88,43.18 S302.1 | 39.69,43.18 39.69,37.78 38.73,36.83 38.73,35.98 C301.2 | C301.2 R304.2 | C301.2 38.84,34.51 39.05,34.29 U303.8 v42.55,34.29 | R303.2 42.01,7.62 Q301.3 39.2,9.04 39.99,9.83 U302.5 41.61,9.83 v41.91,9.53 | U301.5 40.02,13 v39.69,13.34 37.78,13.34 v37.47,13.65
  Bottom 0.203: 42.86,29.53 42.86,33.97 v42.55,34.29 | v41.91,9.53 41.91,12.7 41.27,13.34 v39.69,13.34 | J301.2 42.86,29.53 | 42.86,29.53 39.05,29.53 37.78,28.26 37.78,13.97 v37.47,13.65
EXP_IN
  Top 0.203: D1003.A 138.67,43.18 J1609.1 138.43,34.92 140.34,33.02 U1001.2
EXP_MISO
  Top 0.203: J1005.1 146.05,27.94 145.73,28.26 145.73,31.43 146.05,31.75 U1001.6
EXP_MOSI  (via drill 0.33)
  Top 0.203: U1001.5 149.22,30.48 151.13,28.57 151.13,26.67 149.86,25.4 J1005.4 | R1001.1 R1002.1 139.49,14.5 138.27,15.72 138.27,17.62 140.97,20.32 v141.45,20.32 | v141.45,23.34 v143.18,25.07 v143.18,25.08
  Bottom 0.203: v143.18,25.08 144.78,25.08 145.73,24.13 148.27,24.13 J1005.4 | v141.45,20.32 v141.45,23.34
EXP_OUT  (via drill 0.33)
  Top 0.203: S1002.2 148.59,40.64 149.03,41.08 | 149.03,41.08 J1610.2 150.89,43.18 D1002.A | v150.3,41.08 149.86,41.08 | 149.86,41.08 149.03,41.08 | R1004.1 149.86,41.08
  Bottom 0.203: J1004.2 149.09,13.79 147.64,15.24 144.46,15.24 144.15,15.56 144.15,17.14 142.24,19.05 142.24,29.21 147.96,34.92 148.59,34.92 151.13,37.47 151.13,40.64 150.69,41.08 v150.3,41.08
EXP_RST
  Top 0.203: R1005.1 142.03,34.43 U1001.1 143.51,34.29 143.83,33.97 143.83,32.63 144.45,32.01 144.45,31.49 143.83,30.87 S1001.4 S1001.3 146.75,22.61 J1005.5
EXP_SCK  (via drill 0.33)
  Top 0.203: J1005.3 146.92,25.48 | 146.92,25.48 145.38,27.03 145.38,32.35 146.05,33.02 U1001.7 | R1003.2 147.53,19.63 v146.84,20.32 | v145.1,23.5 145.1,23.65 146.92,25.48
  Bottom 0.203: v146.84,20.32 146.37,20.32 145.1,21.59 v145.1,23.5
EXP_VCC  (via drill 0.41)
  Top 0.203: C1002.+ 145.73,53.15 145.73,52.07 144.78,51.12 143.51,51.12 | 143.51,51.12 U1002.5 | 143.51,51.12 143.19,51.12 142.24,50.16 142.31,50.09 D1004.A | D1004.A 142.31,48.97 142.24,48.9 142.56,48.58 143.83,48.58 144.46,47.94 144.46,45.09 146.41,43.14 | 146.41,43.14 S1002.1 | C1001.2 R1005.2 | C1001.2 145.41,35.77 145.41,34.61 145.73,34.29 U1001.8 v149.22,34.29 | C1001.2 145.52,36.62 146.37,37.47 146.37,43.1 146.41,43.14 | TP1001.TP 140.34,49.53 D1004.A
  Bottom 0.203: v149.22,34.29 149.22,33.97 149.54,33.66 J1005.2 151.13,26.35 151.13,21.91 149.54,20.32 J1004.1
GND  (via drill 0.33, 0.41, 0.51)
  Top 0.203: R102.1 8.47,45.82 8.26,46.04 8.26,48.26 8.57,48.58 9.84,48.58 10.16,48.9 10.16,49.43 R103.1 | C201.1 v26.67,35.88 | U202.4 v18.41,30.48 18.1,30.16 S201.2 S201.1 18.1,21.59 18.41,21.27 26.04,21.27 J204.6 | C202.- 26.8,52.2 25.4,50.8 25.4,49.63 R207.1 25.4,49.43 25.4,48.9 25.08,48.58 23.81,48.58 23.18,47.94 23.18,46.67 24.03,45.82 R205.1 v24.77,44.45 | R206.1 v20.95,44.45 | C302.- 42.04,52.2 40.54,50.7 R307.1 40.32,49.31 40.32,48.9 40.01,48.58 39.37,48.58 38.42,47.62 38.42,46.99 39.59,45.82 R305.1 v40.01,44.45 | v36.2,44.45 R306.1 | U303.4 v33.66,30.48 33.34,30.16 S301.2 S301.1 33.34,21.59 33.66,21.27 42.23,21.27 | C301.1 v41.91,35.88 | C402.- 57.28,52.2 55.88,50.8 55.88,49.63 R408.1 55.88,49.43 55.88,48.9 55.56,48.58 54.29,48.58 53.98,48.26 53.98,46.67 54.83,45.82 R406.1 55.24,44.77 v54.93,44.45 | R407.1 51.44,44.77 v51.75,44.45 | C401.1 v57.15,35.88 | U403.4 v48.9,30.48 48.58,30.16 S401.2 S401.1 48.58,21.59 48.9,21.27 57.47,21.27 58.1,21.91 J401.6 59.05,21.91 59.05,14.61 58.74,14.29 58.12,14.29 U401.3 | C502.- 72.71,53.15 72.71,52.07 71.02,50.38 R507.1 70.8,49.31 70.8,48.58 69.22,48.58 68.9,48.26 68.9,46.67 69.75,45.82 R505.1 70.48,44.77 v70.17,44.45 | v66.99,44.45 66.67,44.77 R506.1 | U503.4 v64.14,30.48 63.82,30.16 S501.2 S501.1 63.82,21.59 | v72.39,35.88 C501.1 | R706.1 v97.47,44.45 | v100.65,44.45 R705.1 99.59,45.82 99.38,46.04 99.38,48.26 99.69,48.58 100.97,48.58 101.5,49.11 R707.1 101.5,50.38 103,51.88 C703.- | C602.- 87.76,51.88 86.26,50.38 R607.1 86.26,49.11 85.72,48.58 84.45,48.58 84.14,48.26 84.14,46.35 84.67,45.82 R605.1 v85.41,44.13
  Top 0.203: R606.1 v82.23,44.13 | 42.23,21.27 42.86,21.91 J301.6 | 63.82,21.59 64.14,21.27 72.71,21.27 73.34,21.91 J503.6 | 79.38,21.27 79.06,21.59 S601.1 S601.2 79.06,30.16 v79.38,30.48 U603.4 | 79.38,21.27 87.63,21.27 88.58,22.23 J603.6 | v87.63,35.88 C601.1 | C701.1 v102.87,35.88 | U702.4 v94.61,30.48 94.3,30.16 S702.2 S702.1 94.3,19.68 v94.61,19.37 | v102.87,19.68 C702.1 | U701.4 v94.61,14.29 94.3,13.97 S701.2 S701.1 94.55,6.41 v95.57,5.4 | J701.2 102.23,4.68 102.91,5.35 102.91,5.75 J703.6 | C801.- 118.24,51.88 116.74,50.38 R806.1 116.74,48.79 116.52,48.58 114.94,48.58 114.62,48.26 114.62,46.35 114.94,46.04 115.67,46.04 R804.1 v115.89,44.13 | v112.71,44.13 R805.1 | C902.- 133.48,51.88 131.98,50.38 R907.1 131.98,49.11 131.44,48.58 130.49,48.58 130.18,48.26 130.18,46.04 130.39,45.82 R905.1 v131.13,44.45 | R906.1 v127.95,44.45 | U901.4 v125.09,30.48 124.78,30.16 S901.2 S901.1 124.78,21.91 125.41,21.27 128.59,21.27 | v133.35,35.88 C901.1 | J903.6 132.72,21.27 128.59,21.27 | R1008.1 147.22,50.7 148.72,52.2 C1002.- | U1001.4 v140.34,30.48 140.02,30.16 S1001.2 S1001.1 140.02,21.59 140.34,21.27 148.59,21.27 149.54,22.23 J1005.6 | C1001.1 v148.59,35.88 149.86,37.15 R1004.2 | v146.2,44.28 146.2,45.65 R1006.1 | R1007.1 v143.19,44.13 | R1105.1 v158.43,44.45 | v161.61,44.45 R1104.1 160.87,45.82 160.66,46.04 160.66,48.26 160.97,48.58 162.24,48.58 162.46,48.79 R1106.1 162.46,52.64 IC1101.3 161.93,53.98 v161.29,54.61 | C1101.1 v163.83,35.88 165.1,37.15 R1101.2 | J1104.6 163.19,21.27 156.53,21.27 | 156.53,21.27 155.57,21.27 155.26,21.59 S1101.1 S1101.2 155.26,30.16 v155.57,30.48 U1102.4
  Top 0.203: U1101.6 159.72,13.99 160.02,14.29 U1101.PAD | C1201.1 v179.07,35.88 180.34,37.15 R1201.2 | U1202.4 v170.81,30.48 170.5,30.16 S1201.2 S1201.1 170.5,21.59 170.81,21.27 172.09,21.27 | J1204.6 178.44,21.27 172.09,21.27 | v176.85,44.45 R1204.1 176.11,45.82 175.9,46.04 175.9,48.26 176.21,48.58 177.16,48.58 177.7,49.11 R1206.1 178.73,50.56 178.73,54.27 | v173.67,44.45 R1205.1 | R1202.2 172.09,20.74 172.09,21.27 | R1102.2 156.53,20.42 156.53,21.27 | 21.59,11.75 20.64,11.75 20.32,12.06 R202.2 | Q201.1 23.18,11.86 23.18,13.34 23.64,13.79 J202.2 | U502.3 63.48,16.52 62.55,17.46 62.55,20.32 62.87,20.64 63.5,20.64 | 63.5,20.64 63.48,20.62 U501.3 | R503.2 66.04,12.06 66.36,11.75 67.31,11.75 | Q501.1 68.58,11.75 68.58,12.84 J501.2 | U201.3 17.77,17.45 v18.41,18.1 | R602.2 81.28,12.06 81.6,11.75 82.55,11.75 | J601.2 84.03,13.05 Q601.1 | U601.3 78.72,20.62 | 78.72,20.62 79.38,21.27 | 63.5,20.64 63.82,20.95 63.82,21.59 | C1401.- 209.68,51.56 208.18,50.06 R1406.1 208.18,49.11 207.65,48.58 206.38,48.58 206.06,48.26 206.06,46.35 206.59,45.82 R1404.1 v207.33,44.45 | R1405.1 v203.84,44.45 | R1305.1 v188.91,44.45 | v192.09,44.45 R1304.1 191.35,45.82 190.82,46.35 190.82,48.26 191.13,48.58 192.72,48.58 192.94,48.79 R1306.1 194.31,50.9 v194.31,52.07 194.27,52.11 IC1301.3 194.09,53.98 193.36,53.24 | U1302.4 v186.06,30.48 185.74,30.16 S1301.2 S1301.1 185.74,21.59 186.06,21.27 187.32,21.27 | C1301.1 v194.31,35.88 195.58,37.15 R1301.2 | J1304.6 195.26,21.91 194.63,21.27 187.32,21.27 | R1302.2 187.11,21.06 187.32,21.27 | R1503.1 223.42,50.38 v224.79,51.75 | R1501.1 223.1,42.89 J1501.3 221.11,45.72 219.18,45.72 R1502.1
  Top 0.203: R803.2 111.76,12.06 112.08,11.75 113.03,11.75 | R902.2 127,12.06 127.32,11.75 128.27,11.75 Q901.1 | R903.2 128.69,21.17 128.59,21.27 | J1003.2 J1002.2 | R1403.2 203.04,12.38 203.68,11.75 204.47,11.75 | R301.1 33.97,3.49 D301.K | R301.1 37.25,4.87 38.1,5.71 38.1,8.89 39.69,10.48 41.59,10.48 42.24,11.13 U302.3 | R404.2 52.49,2.11 R401.1 52.49,4.55 53.02,5.08 58.1,5.08 59.37,6.35 59.37,10.79 59.04,11.13 | U301.3 43.48,14.3 43.5,14.29 43.81,14.61 43.81,15.56 | 42.23,21.27 42.23,20.95 43.81,19.37 43.81,15.56 | 43.81,15.56 v42.86,15.56 | v37.47,1.59 37.25,1.8 R301.1 | U402.3 59.04,11.13 | 59.04,11.13 59.04,11.45 v58.42,12.06 | R1002.2 143.19,12.06 v143.51,11.75 | U602.3 78.11,16.59 78.11,20 78.72,20.62 | IC1501.3 224.75,53.06 v224.79,53.02 | U802.3 115.27,24.78 115.89,25.4 117.16,25.4 | 117.16,25.4 117.79,24.77 118.41,24.77 U801.3 | R801.1 v109.86,16.83 | v116.84,27.3 117.16,26.99 117.16,25.4 | R1401.2 210.82,37.15 v210.5,36.83 | U101.3 11.13,32.05 11.43,31.75 v12.06,31.75 7.62,27.3 S101.P$1 | U1401.3 201.28,18.08 201.93,18.73 203.84,18.73 204.79,17.78 204.79,12.86 v204.47,12.54
  Top 0.305: U1201.6 174.96,13.99 175.26,14.29 U1201.PAD | U1301.6 190.2,13.99 190.5,14.29 U1301.PAD
  Top 0.406: U203.2 20.64,53.66 20.95,53.34 21.91,53.34 22.54,53.98 22.54,54.29 23.18,54.93 24.45,54.93 | 24.45,54.93 26.04,54.93 26.99,53.98 26.99,53.53 C202.- | U304.2 35.88,53.66 36.2,53.34 37.47,53.34 37.78,53.66 37.78,54.29 38.42,54.93 40.01,54.93 | 40.01,54.93 41.59,54.93 42.23,54.29 42.23,53.53 C302.- | U102.2 5.4,53.66 5.71,53.34 6.99,53.34 7.3,53.66 7.3,54.29 7.94,54.93 | 7.94,54.93 11.11,54.93 11.56,54.48 C101.- 11.56,52.84 10.16,51.44 10.16,49.63 R103.1 | 7.94,54.93 v9.21,56.2 | 24.45,54.93 v24.45,55.88 | 40.01,54.93 v40.01,55.88 | U404.2 51.12,53.66 51.44,53.34 52.7,53.34 53.02,53.66 53.02,54.61 53.34,54.93 55.24,54.93 | C402.- 57.28,54.48 56.83,54.93 55.24,54.93 | 55.24,54.93 v55.24,55.88 | 70.8,54.93 68.9,54.93 68.26,54.29 68.26,53.66 67.94,53.34 66.67,53.34 66.36,53.66 U504.2 | 70.8,54.93 71.75,54.93 72.39,54.29 72.39,53.47 C502.- | 70.8,54.93 v70.8,55.88 | U604.2 81.6,53.66 81.92,53.34 83.19,53.34 83.5,53.66 83.5,54.29 84.14,54.93 85.72,54.93 | 85.72,54.93 87,54.93 87.63,54.29 87.63,53.47 C602.- | 85.72,54.93 v85.72,55.88 | U703.2 96.84,53.66 97.16,53.34 98.42,53.34 98.74,53.66 98.74,54.61 99.06,54.93 100.97,54.93 | 100.97,54.93 102.23,54.93 103,54.16 C703.- | 100.97,54.93 v100.97,55.88 | U803.2 112.08,53.66 112.39,53.34 113.67,53.34 113.98,53.66 113.98,54.29 114.62,54.93 115.89,54.93 | 115.89,54.93 117.79,54.93 118.24,54.48 C801.- | 115.89,54.93 v115.89,55.88 | U902.2 127.32,53.66 127.64,53.34 128.91,53.34 129.22,53.66 129.22,54.29 129.86,54.93 131.44,54.93 | 133.35,53.47 C902.- 133.48,54.48 133.03,54.93 131.44,54.93 | 131.44,54.93 v131.44,55.88 | U1002.2 142.56,53.66 142.88,53.34 144.15,53.34 144.46,53.66 144.46,54.61 144.78,54.93 146.37,54.93
  Top 0.406: C1002.- 148.72,54.48 148.27,54.93 146.37,54.93 | 146.37,54.93 v146.37,55.88 | C1103.2 163.05,53.24 163.33,53.52 | 163.33,53.52 IC1101.3 | C1102.1 162.14,54.71 163.33,53.52 | C1203.2 178.29,53.24 IC1201.3 | C1202.1 178.29,54.71 178.73,54.27 IC1201.3 | C1303.2 193.36,53.24 193.53,53.24 IC1301.3 | C1302.1 194.21,54.71 v195.58,53.34 | IC1201.3 180.94,52.07 v181.61,52.07 | U1402.2 203.2,53.66 203.52,53.34 205.1,53.34 205.42,53.66 205.42,54.29 206.06,54.93 207.65,54.93 | 207.65,54.93 209.23,54.93 209.68,54.48 C1401.- | 207.65,54.93 v207.65,55.88 | C1604.2 226.06,20.32 | C1502.2 224.01,53.24 IC1501.3 224.01,54.71 C1501.1 | Q801.3 113.67,9.21 v113.03,9.84 113.03,10.79 113.35,10.48 Q801.2 | Q801.1 113.03,11.75
  Top 0.508: 67.31,11.75 68.58,11.75 | Q501.3 67.63,9.21 67.31,9.53 v67.31,9.84 67.31,10.48 Q501.2 | v82.55,9.84 83.19,9.21 Q601.3 | v82.55,11.11 83.19,10.48 Q601.2 | v82.55,12.38 83.19,11.75 Q601.1 | J1501.3 225.87,43.31 226.06,43.5 | Q901.3 128.91,9.21 v128.27,9.84 128.27,10.79 | Q901.2 128.91,10.48 v128.27,11.11 | Q1001.1 v143.51,11.75 143.51,12.84 J1003.2 | Q1001.3 144.15,9.21 v143.51,9.84 | Q1001.2 143.83,10.48 v143.51,10.79 | Q1401.3 204.95,9.21 204.47,9.68 v204.47,10.16 204.47,10.95 | 204.47,10.95 v204.47,11.27 204.47,11.75 | Q1401.2 204.95,10.48 204.47,10.95 | Q1401.1 204.47,11.75 | 204.47,11.75 v204.47,12.54
  Top 0.61: IC1101.3 162.56,53.98 | v160.02,17.14 U1101.PAD | v175.26,16.92 U1201.PAD | Q201.3 21.91,9.21 21.59,9.53 v21.59,9.84 21.59,10.79 21.91,10.48 Q201.2 | Q201.1 21.59,11.75 | v190.5,16.87 U1301.PAD | 113.03,12.06 113.03,11.75 v113.03,11.11 113.03,10.79
  Top 0.762: 21.59,10.79 v21.59,11.11 21.59,11.75 v21.59,12.38 | v67.31,12.38 67.31,11.75 v67.31,11.11 67.31,10.48 | v82.55,12.38 82.55,11.75 v82.55,11.11 v82.55,9.84 | 113.03,11.75 v113.03,12.38 | v128.27,12.38 128.27,11.75 v128.27,11.11 128.27,10.79 | v143.51,9.84 v143.51,10.79 v143.51,11.75
  Top 1.27: X1601.2 223.52,10.79 226.06,13.34 226.06,15.24 | 227.01,54.29 226.69,54.61 226.06,53.98 IC1501.3 226.06,52.66 226.06,43.5 226.06,35.88 | 226.06,15.24 226.06,20.32 226.06,23.18 | 226.06,23.18 226.06,28.57 | 226.06,28.57 226.06,35.88 | C1601.- 226.06,35.88 | C1602.- 226.06,28.57 | C1603.- 226.06,15.24 | D1601.A 226.06,23.18
  Bottom 0.203: v18.41,30.48 18.41,34.61 19.68,35.88 v26.67,35.88 27.3,35.88 27.94,36.51 27.94,41.59 27.3,42.23 27.3,43.18 26.04,44.45 v24.77,44.45 24.45,44.13 21.59,44.13 v20.95,44.45 | v36.2,44.45 36.51,44.13 39.69,44.13 v40.01,44.45 43.18,41.27 43.18,37.15 v41.91,35.88 34.92,35.88 33.66,34.61 v33.66,30.48 | v51.75,44.45 v54.93,44.45 55.24,44.45 58.42,41.27 58.42,37.15 v57.15,35.88 50.16,35.88 48.9,34.61 v48.9,30.48 | v66.99,44.45 v70.17,44.45 73.66,40.96 73.66,37.15 v72.39,35.88 65.41,35.88 64.14,34.61 v64.14,30.48 | v97.47,44.45 97.79,44.13 100.33,44.13 v100.65,44.45 104.14,40.96 104.14,37.15 v102.87,35.88 95.89,35.88 94.61,34.61 v94.61,30.48 | v82.23,44.13 v85.41,44.13 88.9,40.64 88.9,37.15 v87.63,35.88 80.64,35.88 79.38,34.61 v79.38,30.48 | v94.61,14.29 94.61,14.92 93.98,15.56 93.98,17.78 94.61,18.41 v94.61,19.37 94.93,19.68 v102.87,19.68 102.87,21.91 J704.6 | J701.2 99.06,5.08 95.89,5.08 v95.57,5.4 | v115.89,44.13 115.57,44.13 | 115.57,44.13 v112.71,44.13 | 109.86,30.48 109.86,34.61 111.12,35.88 v118.11,35.88 119.38,37.15 119.38,40.32 115.57,44.13 | v127.95,44.45 128.27,44.13 131.13,44.13 v131.13,44.45 134.62,40.96 134.62,37.15 v133.35,35.88 125.73,35.88 125.09,35.24 v125.09,30.48 | v140.34,30.48 140.34,34.92 141.29,35.88 v148.59,35.88 149.86,37.15 149.86,40.64 146.22,44.28 | 146.22,44.28 v146.2,44.28 | v143.19,44.13 146.07,44.13 146.22,44.28 | v158.43,44.45 v161.61,44.45 165.1,40.96 165.1,37.15 v163.83,35.88 156.21,35.88 155.57,35.24 v155.57,30.48 | v170.81,30.48 170.81,35.24 171.45,35.88 v179.07,35.88 180.34,37.15 180.34,40.96 v176.85,44.45 v173.67,44.45
  Bottom 0.203: J202.2 27.57,13.79 J201.3 | v203.84,44.45 204.15,44.13 207.01,44.13 v207.33,44.45 210.82,40.96 210.82,37.15 v210.5,36.83 209.55,35.88 201.93,35.88 201.29,35.24 201.29,30.48 | v188.91,44.45 189.23,44.13 191.77,44.13 v192.09,44.45 195.58,40.96 195.58,37.15 v194.31,35.88 186.69,35.88 186.06,35.24 v186.06,30.48 | v42.86,15.56 42.86,11.43 44.45,9.84 44.45,1.91 44.13,1.59 v37.47,1.59 | v58.42,12.06 58.42,16.9 56.53,18.79 56.53,19.31 58.1,20.88 J401.6 | 109.86,21.91 115.25,27.3 v116.84,27.3 | v12.06,31.75 12.06,53.34 v9.21,56.2
  Bottom 0.406: v9.21,56.2 11.43,58.42 12.38,58.42 | v24.45,55.88 26.99,58.42 | v40.01,55.88 42.55,58.42 | v55.24,55.88 57.78,58.42 | v70.8,55.88 70.8,56.2 73.03,58.42 | v85.72,55.88 85.72,56.2 87.95,58.42 | v100.97,55.88 103.5,58.42 | v115.89,55.88 118.11,58.1 118.11,58.42 | v131.44,55.88 133.67,58.1 133.67,58.42 | v146.37,55.88 148.91,58.42 149.54,58.42 | v207.65,55.88 210.19,58.42 210.5,58.42
  Bottom 0.457: 12.38,58.42 12.7,58.42
  Bottom 0.508: 12.7,58.42 13.02,58.42 | v204.47,12.54 v204.47,11.27 v204.47,10.16
  Bottom 0.61: 13.02,58.42 13.34,58.42 | 161.93,58.42 162.24,58.42 | v161.29,52.07 159.7,52.07 156.34,48.7 156.34,44.64 156.53,44.45 156.53,40.64 154.62,38.73 154.62,19.05 154.94,18.73 156.21,18.73 156.84,18.1 159.07,18.1 v160.02,17.14 | v177.8,55.88 177.8,56.2 180.02,58.42 | v162.56,55.88 165.1,58.42 | v176.53,52.07 176.21,51.75 174.62,51.75 | 174.62,51.75 173.35,51.75 | v175.26,16.92 175.26,17.14 174.62,17.78 172.09,17.78 171.13,18.73 169.86,18.73 169.86,38.73 171.77,40.64 171.77,44.77 171.58,44.96 171.58,48.7 174.62,51.75 | v193.04,55.88 195.58,58.42 195.9,58.42 | v191.77,52.07 190.18,52.07 186.82,48.7 186.82,44.96 187.01,44.77 187.01,40.64 185.1,38.73 185.1,18.73 186.37,18.73 187.32,17.78 189.59,17.78 v190.5,16.87 | v204.47,12.54 203.2,13.81 201.45,13.81 200.98,14.29 200.98,30.16 201.29,30.48 201.29,40.96 202.09,41.75 202.09,44.77 | 201.77,58.42 201.45,58.1 201.45,53.02 200.98,52.55 200.98,52.67
  Bottom 0.762: 20.64,58.42 20,57.78 20,41.27 18.41,39.37 v18.41,18.1 18.41,15.56 v21.59,12.38 v21.59,11.11 v21.59,9.84 | 65.72,58.42 65.72,41.59 64.14,40.01 v64.14,30.48 64.14,15.56 v67.31,12.38 v67.31,11.11 v67.31,9.84 | 81.28,58.42 80.64,57.78 80.64,41.27 79.38,40.01 v79.38,30.48 79.38,15.56 v82.55,12.38 v82.55,11.11 v82.55,9.84 | 112.08,58.42 111.12,57.47 111.12,41.27 109.86,40.01 109.86,21.91 v109.86,16.83 109.86,15.56 v113.03,12.38 v113.03,11.11 v113.03,9.84 | 127,58.42 126.36,57.78 126.36,41.27 125.09,40.01 125.09,15.56 v128.27,12.38 v128.27,11.11 v128.27,9.84 | 141.6,58.42 141.6,41.59 140.34,40.32 v140.34,30.48 140.34,12.38 140.65,12.06 143.19,12.06 v143.51,11.75 v143.51,10.79 v143.51,9.84
  Bottom 0.813: 13.34,58.42 13.65,58.42
  Bottom 1.016: 13.65,58.42 13.97,58.42
  Bottom 1.27: 13.97,58.42 20.64,58.42 26.99,58.42 42.55,58.42 57.78,58.42 65.72,58.42 73.03,58.42 81.28,58.42 87.95,58.42 103.5,58.42 112.08,58.42 118.11,58.42 127,58.42 133.67,58.42 141.6,58.42 149.54,58.42 162.24,58.42 165.1,58.42 180.02,58.42 195.9,58.42 201.77,58.42 210.5,58.42 216.22,58.42 218.44,56.2
  other vias: 161.29,55.88 161.29,53.34 162.56,52.07 162.56,53.34 162.56,54.61 163.83,55.88 165.1,55.88 165.1,54.61 163.83,54.61 163.83,53.34 163.83,52.07 165.1,52.07 166.37,52.07 165.1,53.34 166.37,53.34 166.37,54.61 166.37,55.88 176.53,55.88 179.07,55.88 180.34,55.88 181.61,55.88 181.61,54.61 181.61,53.34 180.34,54.61 180.34,53.34 179.07,53.34 177.8,53.34 176.53,53.34 176.53,54.61 177.8,52.07 179.07,52.07 180.34,52.07 179.07,54.61 177.8,54.61 191.77,55.88 194.31,55.88 195.58,55.88 196.85,55.88 191.77,54.61 193.04,54.61 194.31,54.61 195.58,54.61 196.85,54.61 191.77,53.34 193.04,53.34 194.31,53.34 196.85,53.34 193.04,52.07 195.58,52.07 196.85,52.07 222.25,55.56 223.52,55.56 224.79,55.56 226.06,55.56 227.33,55.56 222.25,54.29 223.52,54.29 224.79,54.29 226.06,54.29 227.33,54.29 227.33,53.02 227.33,51.75 226.06,51.75 223.52,51.75 222.25,51.75 222.25,53.02 223.52,53.02 226.06,53.02
  pour Bottom: 216.53,51.12 227.65,51.12 227.65,56.83
  pour Top (isolate 0.254): 0,0 228.92,0 228.92,60.96 0,60.96
  pour Bottom (isolate 0.254): 0,0 228.92,0 228.92,60.96 0,60.96
IMA0.5_IN
  Top 0.203: D1403.A 199.39,43.26 J1613.1 200.03,42.55 200.03,18.73 | JP1401.1 199.71,17.23 199.71,18.41 200.03,18.73 | 200.03,18.73 U1401.2
IMA0.5_OUT  (via drill 0.33)
  Top 0.203: S1401.2 209.55,40.64 | 209.55,40.64 J1614.2 211.85,43.18 D1402.A | 209.55,40.64 209.55,40.32 209.97,39.9 R1401.1 210.82,40.48 v211.61,41.27
  Bottom 0.203: J1401.2 204.33,13.79 201.77,16.35 201.77,26.99 211.93,37.15 211.93,40.8 211.61,41.12 v211.61,41.27
IMA0.5_VCC
  Top 0.203: C1401.+ 206.88,52.26 205.74,51.12 204.15,51.12 | 204.15,51.12 203.28,50.24 D1404.A | 204.15,51.12 U1402.5 | U1401.5 204,19.38 | 204,19.38 J1401.1 | 204,19.38 204,34.45 207.33,37.78 207.33,42.23 208.24,43.14 S1401.1 207.37,43.14 205.1,45.4 205.1,48.26 204.79,48.58 203.52,48.58 203.28,48.82 D1404.A | TP1402.TP 201.29,49.53 D1404.A
IMA7_IN
  Top 0.203: D1302.A 184.39,43.18 J1612.1 184.15,33.66 184.78,33.02 U1302.2
IMA7_MISO  (via drill 0.33)
  Top 0.203: J1304.1 191.17,29.49 191.17,31.11 191.81,31.75 U1302.6 | v193.98,17.78 193.71,17.51 193.71,15.73 193.07,15.09 191.65,15.09 U1301.9
  Bottom 0.203: v193.98,17.78 193.04,17.78 191.13,19.68 191.13,26.35 J1304.1
IMA7_MOSI  (via drill 0.33)
  Top 0.203: U1302.5 194.94,30.48 196.85,28.57 196.85,26.99 J1304.4 | U1301.10 191.62,15.56 193.04,15.56 193.36,15.88 v193.36,18.73
  Bottom 0.203: v193.36,18.73 196.85,22.23 196.85,24.77 196.22,25.4 J1304.4
IMA7_OUT  (via drill 0.33)
  Top 0.203: S1302.2 194.31,40.64 | 194.31,40.64 J1613.2 196.61,43.18 D1301.A | 194.31,40.64 195.05,39.9 R1301.1 196.11,39.9 v196.85,40.64 | v195.58,19.68 195.26,20 193.68,20 192.09,18.41 188.91,18.41 v188.28,19.05
  Bottom 0.203: J1301.2 197.17,15.38 197.17,19.05 196.53,19.68 v195.58,19.68 | v188.28,19.05 187.32,20 187.32,27.94 194.63,35.24 195.26,35.24 196.85,36.83 v196.85,40.64
IMA7_RST
  Top 0.203: R1303.1 187.75,34.43 U1302.1 189.23,34.29 189.55,33.97 189.55,32.95 190.17,32.33 190.17,31.81 189.55,31.19 S1301.4 S1301.3 192.47,22.61 J1304.5
IMA7_SCK  (via drill 0.33)
  Top 0.203: U1302.7 191.77,33.02 190.82,32.07 190.82,26.99 | J1304.3 191.77,25.4 190.82,26.35 190.82,26.99 | v189.87,19.05 188.81,20.11 R1302.1 | v190.18,26.67 190.5,26.67 190.82,26.99
  Bottom 0.203: J1302.2 191.95,18.24 191.13,19.05 | 191.13,19.05 v189.87,19.05 | 191.13,19.05 188.59,21.59 188.59,25.08 v190.18,26.67
IMA7_VCC  (via drill 0.33, 0.51)
  Top 0.152: IC1301.2 188.04,50.63 D1303.A
  Top 0.203: R1303.2 191.13,35.88 | 191.13,35.88 C1301.2 191.13,35.77 191.13,34.61 191.45,34.29 U1302.8 v194.94,34.29 195.9,33.34 TP1301.TP | S1302.1 192.13,43.14 | 192.13,43.14 190.18,45.09 190.18,48.26 189.87,48.58 188.28,48.58 188.04,48.82 D1303.A | 192.13,43.14 192.13,37.82 191.13,36.83 191.13,35.88 | J1302.1 190.32,12.7 190.5,12.7 190.82,13.02 191.91,13.02 J1301.1
  Top 0.305: 192.7,16.49 192.2,15.99 U1301.11 | 192.72,16.51 192.7,16.49 | 192.7,16.49 U1301.12 | U1301.1 189.43,16.51 188.91,16.51 188.28,17.14 188.28,17.78
  Top 0.406: IC1301.2 184.62,51.7 C1303.1
  Top 0.61: IC1301.2 186.97,50.45 185.74,49.21 v184.78,49.21 | v184.15,18.73 186.37,18.73 187.32,17.78 188.28,17.78 192.09,17.78 192.72,17.14 192.72,16.51